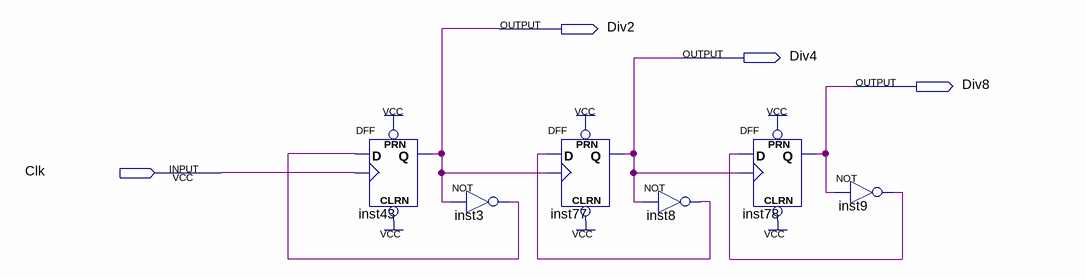
[diagram p0: schematic sheet]
// Quartus schematic DivisorDeFrequencia.bdf as structural Verilog: 6 symbols, 4 pins
module DivisorDeFrequencia (
  input  Clk,
  output Div2,
  output Div4,
  output Div8
);

  wire inst3_out, inst8_out, inst9_out;

  DFF inst43 (.CLRN(1'b1), .CLK(Clk), .D(inst3_out), .PRN(1'b1), .Q(Div2));
  not inst3 (inst3_out, Div2);
  DFF inst77 (.CLRN(1'b1), .CLK(Div2), .D(inst8_out), .PRN(1'b1), .Q(Div4));
  not inst8 (inst8_out, Div4);
  DFF inst78 (.CLRN(1'b1), .CLK(Div4), .D(inst9_out), .PRN(1'b1), .Q(Div8));
  not inst9 (inst9_out, Div8);
endmodule
